# Altium schematic sheet Power.SchDoc
size A
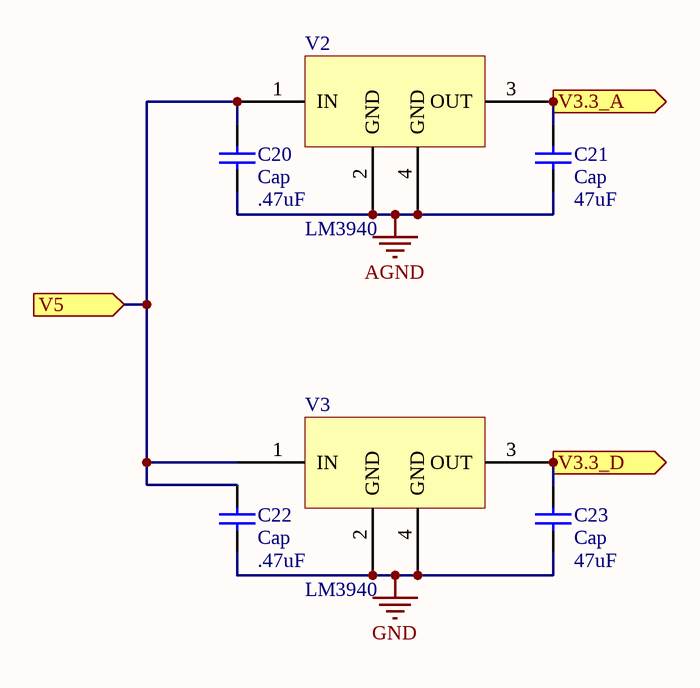
[diagram p0: Power.SchDoc]

## Parts
C20  Cap  value .47uF  [1608[0603]]
C21  Cap  value 47uF  [1608[0603]]
C22  Cap  value .47uF  [1608[0603]]
C23  Cap  value 47uF  [1608[0603]]
V2  LM3940  [SOT230P700X170-4N]
V3  LM3940  [SOT230P700X170-4N]

## Ports
V3.3_A (out), V3.3_D (out), V5 (in)

## Nets
AGND: C20.1 C21.1 V2.2(GND) V2.4(GND)
GND: C22.1 C23.1 V3.2(GND) V3.4(GND)
V3.3_A: C21.2 V2.3(OUT) ; port V3.3_A
V3.3_D: C23.2 V3.3(OUT) ; port V3.3_D
V5: C20.2 C22.2 V2.1(IN) V3.1(IN) ; port V5

## Library data of the parts
C20-C23 = Cap: Capacitor; Published: 8-Jun-2000; LatestRevisionDate: 17-Jul-2002; LatestRevisionNote: Re-released for DXP Platform.; PackageReference: RAD-0.3; Publisher: Altium Limited; PackageDescription: Radial Cap, Thru-Hole; 2 Leads; 0.3 in Pin Spacing